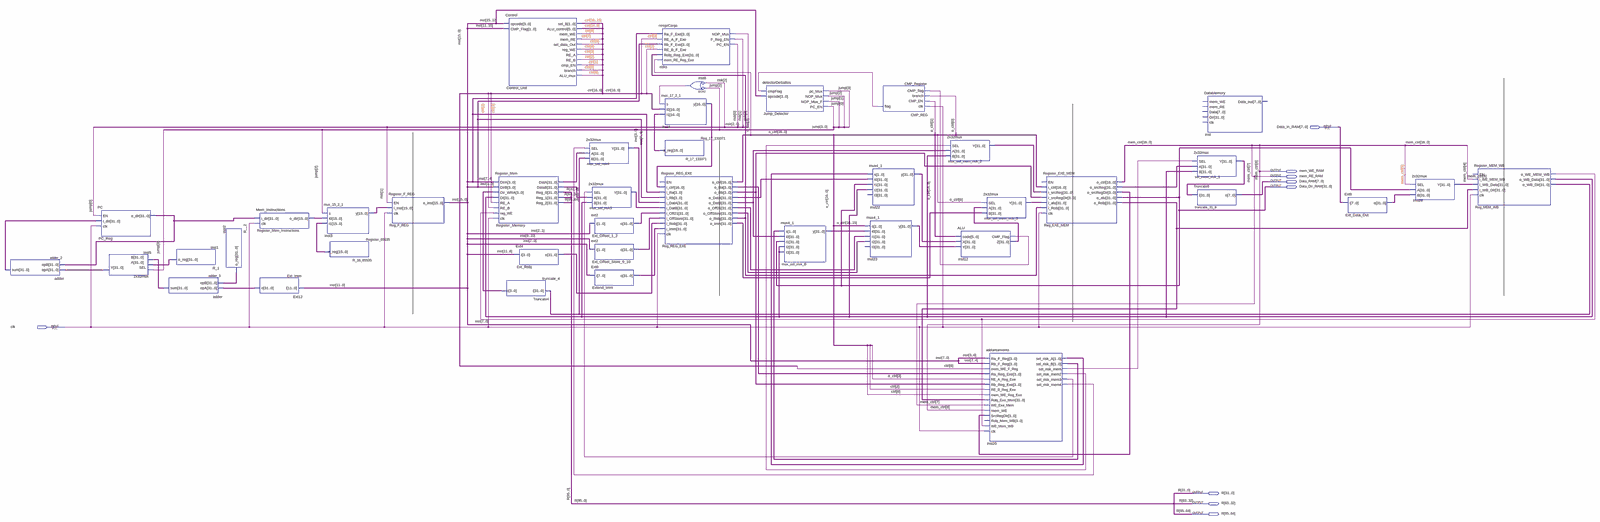
[diagram p0: schematic sheet, whole]
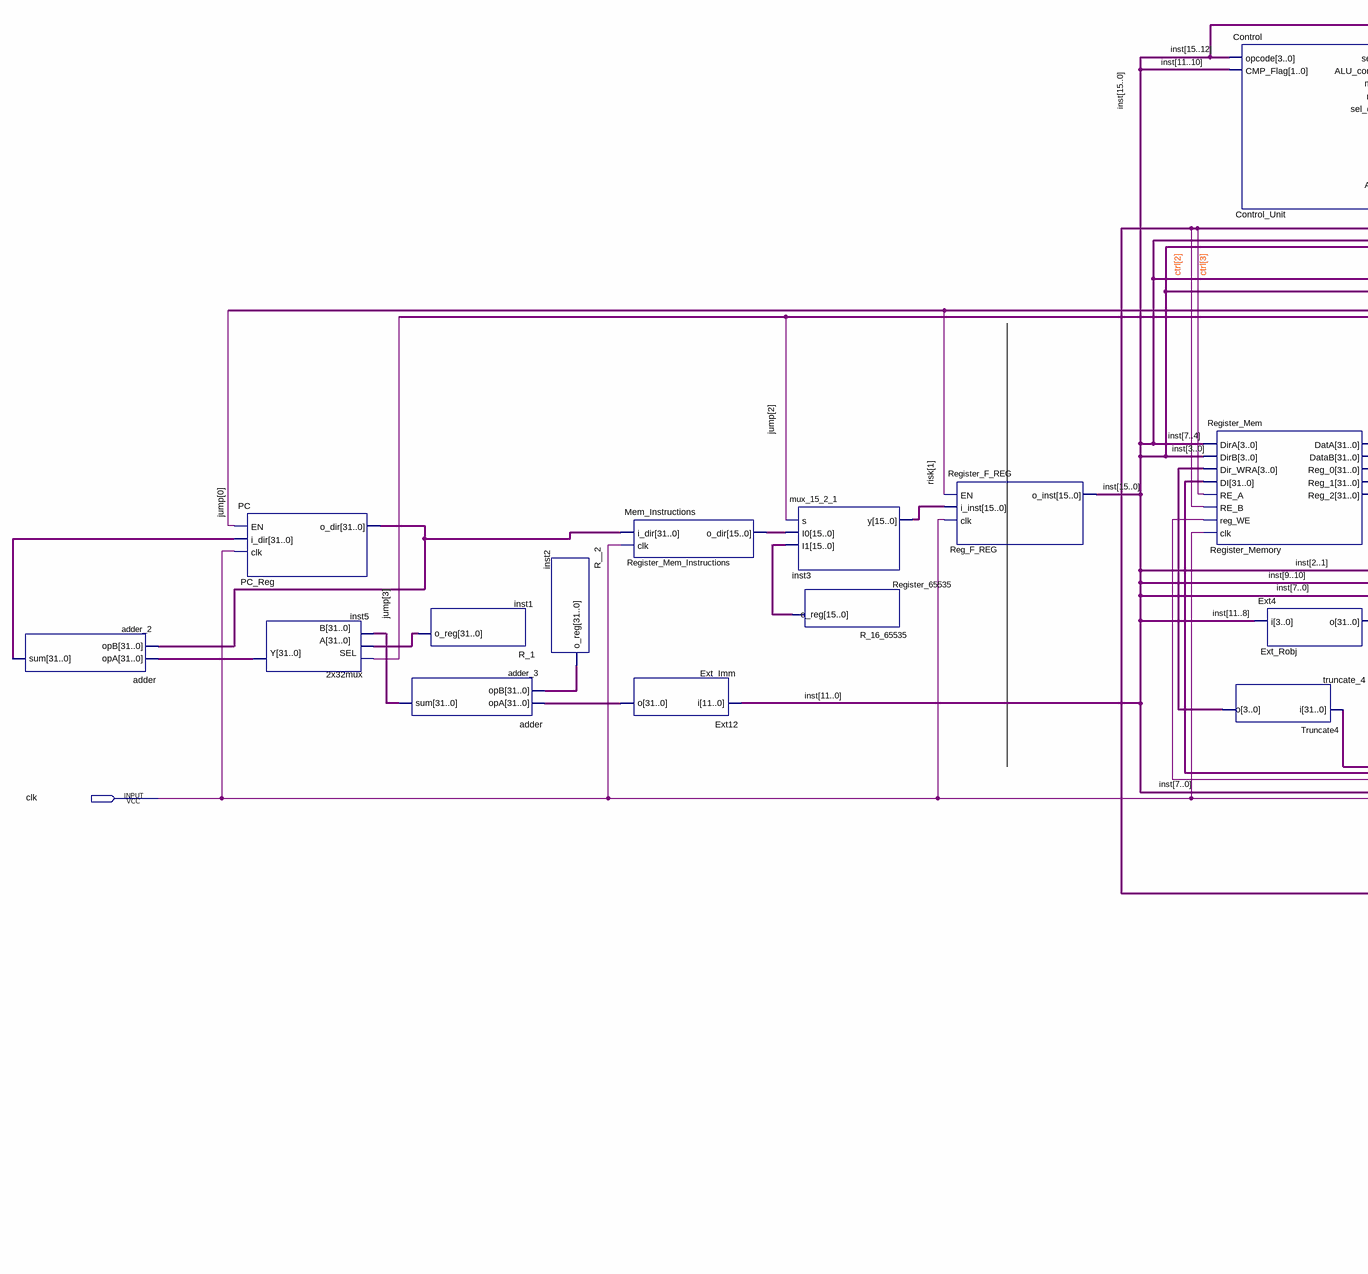
[diagram p1: schematic sheet, left part]
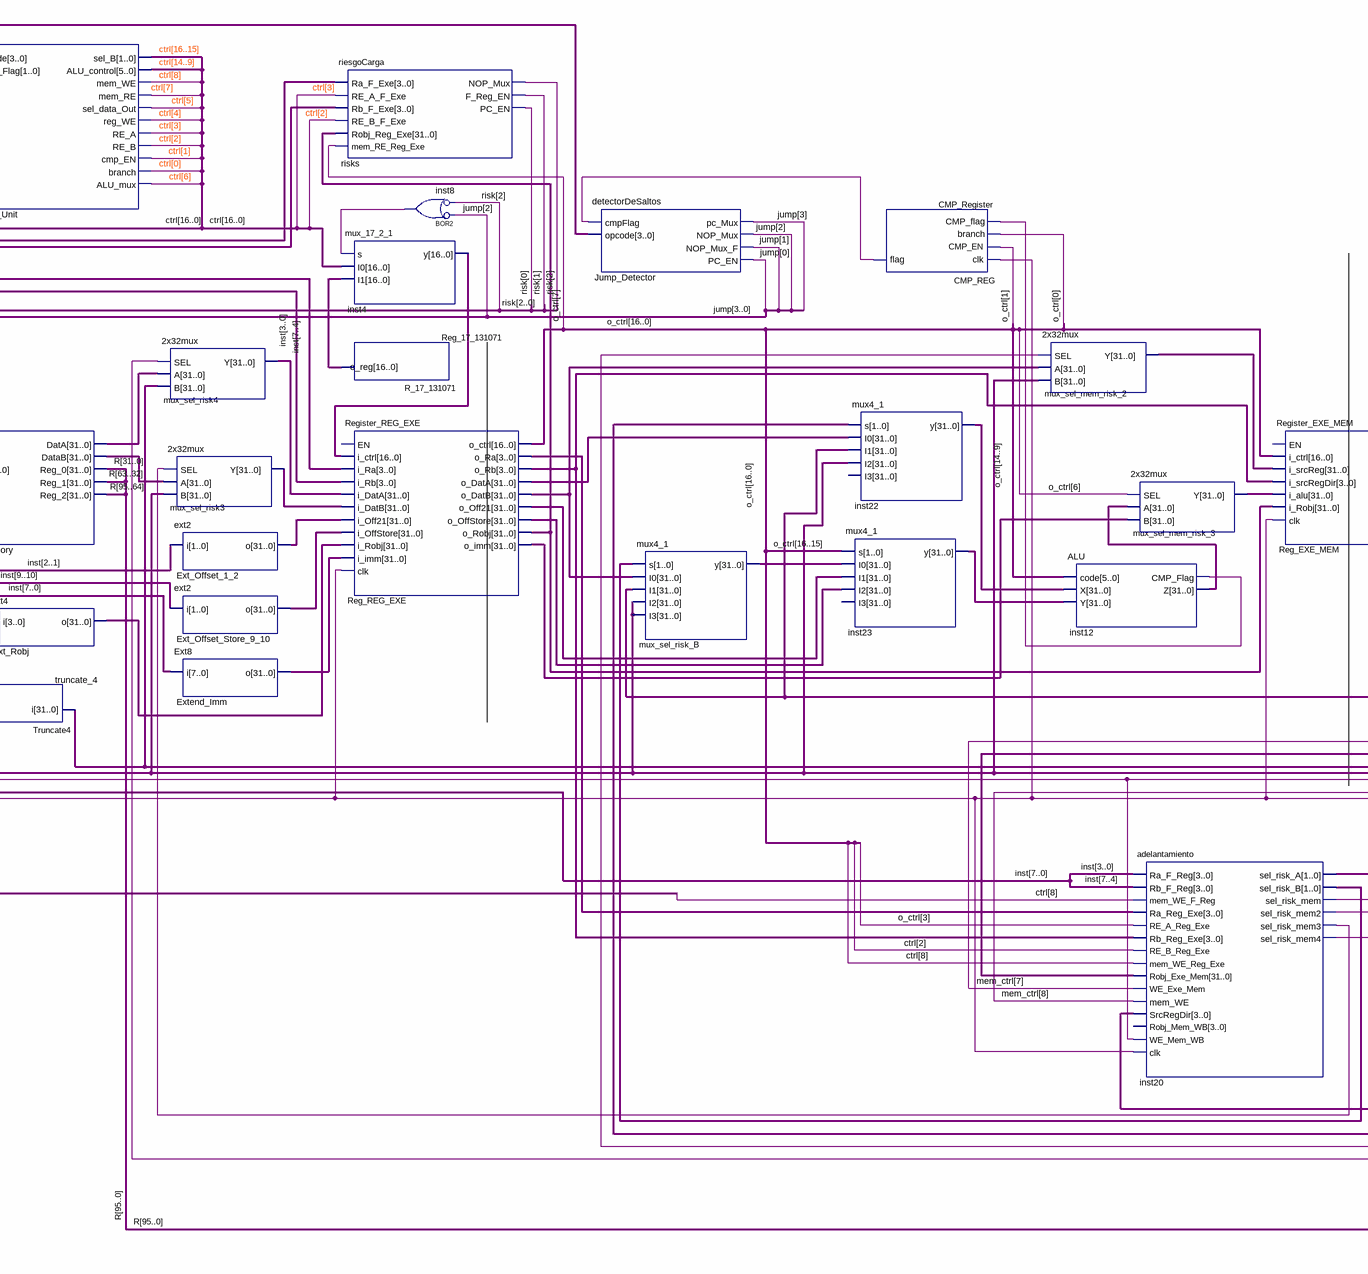
[diagram p2: schematic sheet, centre part]
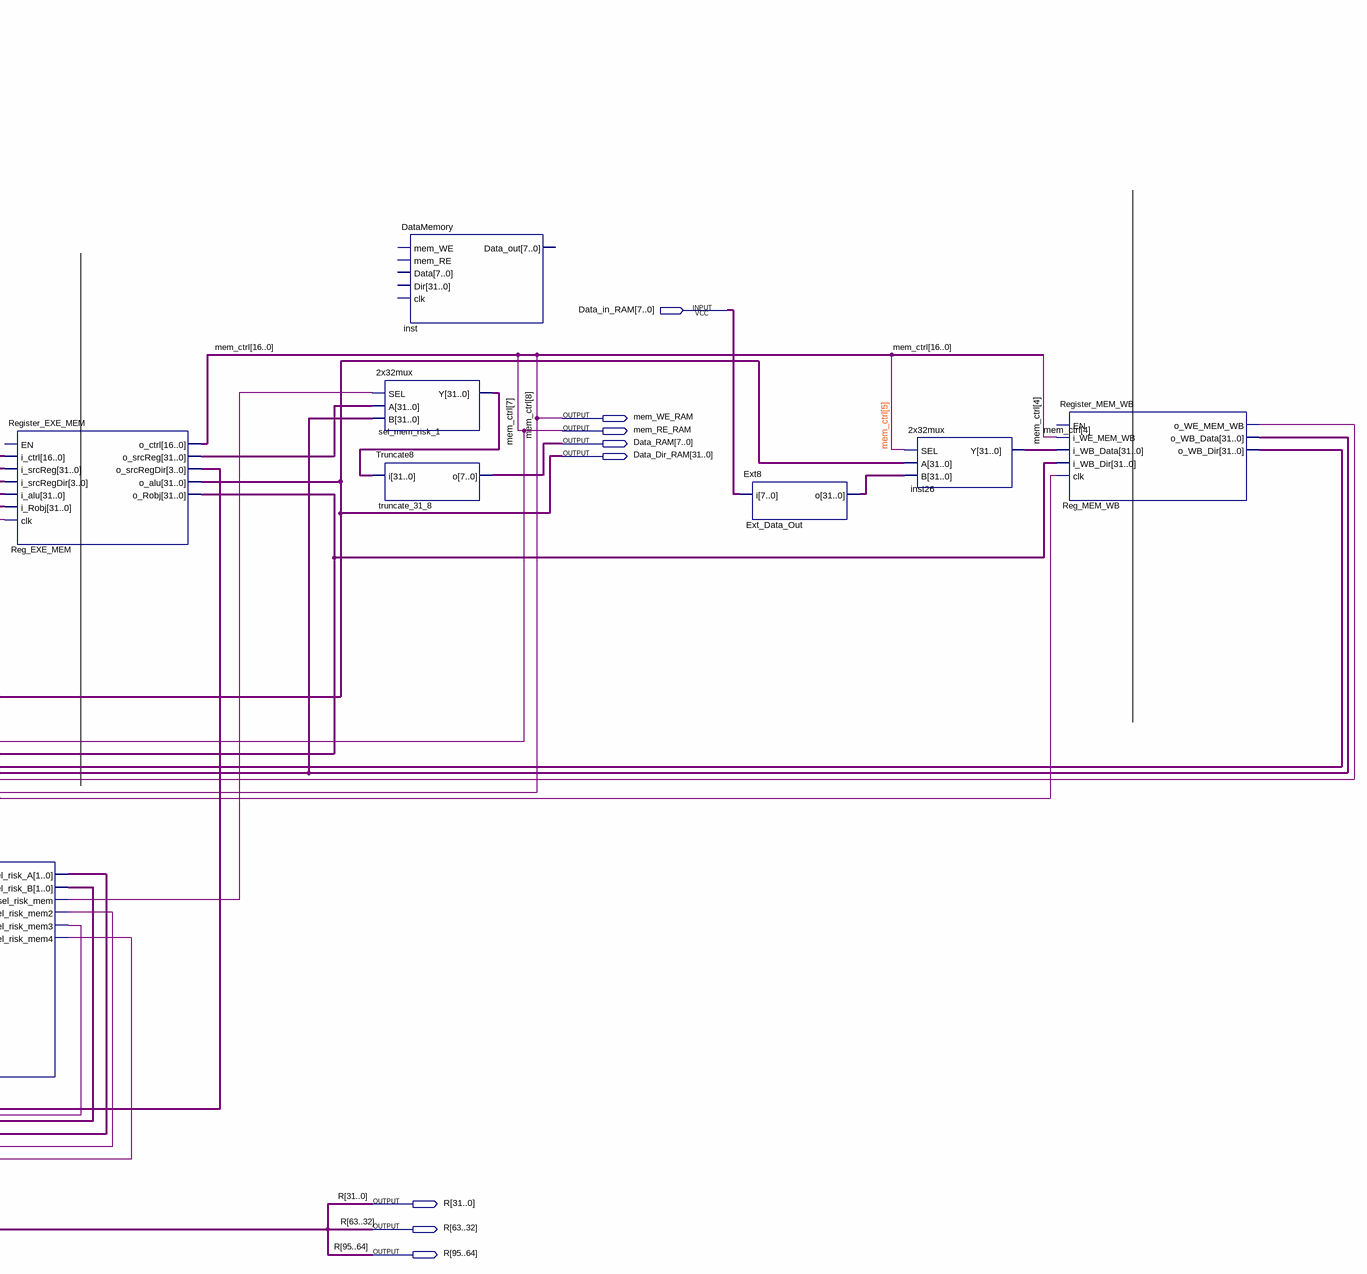
[diagram p3: schematic sheet, right part]
// Quartus schematic ProcesadorFiltros.bdf as structural Verilog: 41 symbols, 9 pins
module ProcesadorFiltros (
  input  [7:0] Data_in_RAM,
  input  clk,
  output mem_WE_RAM,
  output mem_RE_RAM,
  output [7:0] Data_RAM,
  output [31:0] Data_Dir_RAM,
  output [95:0] R
);

  wire CMP_Register_flag, inst8_out, inst12_cmp_flag, inst20_sel_risk_mem, inst20_sel_risk_mem2,
       inst20_sel_risk_mem3, inst20_sel_risk_mem4, Reg_MEM_WB_o_we_mem_wb;
  wire [1:0] inst20_sel_risk_a, inst20_sel_risk_b;
  wire [2:0] risk;
  wire [3:0] jump, Reg_EXE_MEM_o_srcregdir, Reg_REG_EXE_o_ra, Reg_REG_EXE_o_rb, truncate_4_o;
  wire [15:0] inst, inst3_y, Register_65535_o_reg, Register_Mem_Instructions_o_dir;
  wire [16:0] ctrl, inst4_y, mem_ctrl, o_ctrl, Reg_17_131071_o_reg;
  wire [31:0] adder_2_sum, adder_3_sum, Ext_Data_Out_o, Ext_Imm_o, Ext_Offset_1_2_o, Ext_Offset_Store_9_10_o,
       Ext_Robj_o, Extend_Imm_o, inst1_o_reg, inst2_o_reg, inst5_y, inst12_z, inst22_y, inst23_y, inst26_y,
       mux_sel_mem_risk_2_y, mux_sel_mem_risk_3_y, mux_sel_risk3_y, mux_sel_risk4_y, mux_sel_risk_B_y,
       PC_Reg_o_dir, Reg_EXE_MEM_o_robj, Reg_EXE_MEM_o_srcreg, Reg_MEM_WB_o_wb_data, Reg_MEM_WB_o_wb_dir,
       Reg_REG_EXE_o_data, Reg_REG_EXE_o_datb, Reg_REG_EXE_o_imm, Reg_REG_EXE_o_off21,
       Reg_REG_EXE_o_offstore, Reg_REG_EXE_o_robj, Register_Memory_data, Register_Memory_datab,
       sel_mem_risk_1_y;

  adder adder_2 (.opA(inst5_y), .opB(PC_Reg_o_dir), .sum(adder_2_sum));
  PC PC_Reg (.EN(jump[0]), .i_dir(adder_2_sum), .clk(clk), .o_dir(PC_Reg_o_dir));
  \2x32mux  inst5 (.SEL(jump[3]), .A(inst1_o_reg), .B(adder_3_sum), .Y(inst5_y));
  R_1 inst1 (.o_reg(inst1_o_reg));
  adder adder_3 (.opA(Ext_Imm_o), .opB(inst2_o_reg), .sum(adder_3_sum));
  R__2 inst2 (.o_reg(inst2_o_reg));
  Mem_Instructions Register_Mem_Instructions (.i_dir(PC_Reg_o_dir), .clk(clk), .o_dir(Register_Mem_Instructions_o_dir));
  Ext12 Ext_Imm (.i(inst[11:0]), .o(Ext_Imm_o));
  mux_15_2_1 inst3 (.s(jump[2]), .I0(Register_Mem_Instructions_o_dir), .I1(Register_65535_o_reg), .y(inst3_y));
  R_16_65535 Register_65535 (.o_reg(Register_65535_o_reg));
  Register_F_REG Reg_F_REG (.EN(risk[1]), .i_inst(inst3_y), .clk(clk), .o_inst(inst));
  Register_Mem Register_Memory (
    .DirA(inst[7:4]), .DirB(inst[3:0]), .Dir_WRA(truncate_4_o), .DI(Reg_MEM_WB_o_wb_data), .RE_A(ctrl[3]),
    .RE_B(ctrl[2]), .reg_WE(Reg_MEM_WB_o_we_mem_wb), .clk(clk), .DatA(Register_Memory_data),
    .DataB(Register_Memory_datab), .Reg_0(R[31:0]), .Reg_1(R[63:32]), .Reg_2(R[95:64]));
  Control Control_Unit (
    .opcode(inst[15:12]), .CMP_Flag(inst[11:10]), .sel_B(ctrl[16:15]), .ALU_control(ctrl[14:9]),
    .mem_WE(ctrl[8]), .mem_RE(ctrl[7]), .sel_data_Out(ctrl[5]), .reg_WE(ctrl[4]), .RE_A(ctrl[3]),
    .RE_B(ctrl[2]), .cmp_EN(ctrl[1]), .branch(ctrl[0]), .ALU_mux(ctrl[6]));
  Ext4 Ext_Robj (.i(inst[11:8]), .o(Ext_Robj_o));
  Truncate4 truncate_4 (.i(Reg_MEM_WB_o_wb_dir), .o(truncate_4_o));
  \2x32mux  mux_sel_risk4 (
    .SEL(inst20_sel_risk_mem4), .A(Register_Memory_data), .B(Reg_MEM_WB_o_wb_dir), .Y(mux_sel_risk4_y));
  \2x32mux  mux_sel_risk3 (
    .SEL(inst20_sel_risk_mem3), .A(Register_Memory_datab), .B(Reg_MEM_WB_o_wb_data), .Y(mux_sel_risk3_y));
  ext2 Ext_Offset_1_2 (.i(inst[2:1]), .o(Ext_Offset_1_2_o));
  ext2 Ext_Offset_Store_9_10 (.i({inst[9], inst[10]}), .o(Ext_Offset_Store_9_10_o));
  Ext8 Extend_Imm (.i(inst[7:0]), .o(Extend_Imm_o));
  riesgoCarga risks (
    .Ra_F_Exe(inst[7:4]), .RE_A_F_Exe(ctrl[3]), .Rb_F_Exe(inst[3:0]), .RE_B_F_Exe(ctrl[2]),
    .Robj_Reg_Exe(Reg_REG_EXE_o_robj), .mem_RE_Reg_Exe(o_ctrl[7]), .NOP_Mux(risk[2]), .F_Reg_EN(risk[1]),
    .PC_EN(risk[0]));
  mux_17_2_1 inst4 (.s(inst8_out), .I0(ctrl), .I1(Reg_17_131071_o_reg), .y(inst4_y));
  R_17_131071 Reg_17_131071 (.o_reg(Reg_17_131071_o_reg));
  Register_REG_EXE Reg_REG_EXE (
    .i_ctrl(inst4_y), .i_Ra(inst[7:4]), .i_Rb(inst[3:0]), .i_DatA(mux_sel_risk4_y), .i_DatB(mux_sel_risk3_y),
    .i_Off21(Ext_Offset_1_2_o), .i_OffStore(Ext_Offset_Store_9_10_o), .i_Robj(Ext_Robj_o),
    .i_imm(Extend_Imm_o), .clk(clk), .o_ctrl(o_ctrl), .o_Ra(Reg_REG_EXE_o_ra), .o_Rb(Reg_REG_EXE_o_rb),
    .o_DatA(Reg_REG_EXE_o_data), .o_DatB(Reg_REG_EXE_o_datb), .o_Off21(Reg_REG_EXE_o_off21),
    .o_OffStore(Reg_REG_EXE_o_offstore), .o_Robj(Reg_REG_EXE_o_robj), .o_imm(Reg_REG_EXE_o_imm));  // open: EN
  or inst8 (inst8_out, ~jump[2], ~risk[2]);  // BOR2
  detectorDeSaltos Jump_Detector (
    .cmpFlag(CMP_Register_flag), .opcode(inst[15:12]), .pc_Mux(jump[3]), .NOP_Mux(jump[2]),
    .NOP_Mux_F(jump[1]), .PC_EN(jump[0]));
  mux4_1 mux_sel_risk_B (
    .s(inst20_sel_risk_b), .I0(Reg_REG_EXE_o_datb), .I1(Data_Dir_RAM), .I2(Reg_MEM_WB_o_wb_data),
    .I3(Reg_MEM_WB_o_wb_data), .y(mux_sel_risk_B_y));
  mux4_1 inst22 (
    .s(inst20_sel_risk_a), .I0(Reg_REG_EXE_o_data), .I1(Data_Dir_RAM), .I2(Reg_MEM_WB_o_wb_data), .y(inst22_y));  // open: I3
  mux4_1 inst23 (
    .s(o_ctrl[16:15]), .I0(mux_sel_risk_B_y), .I1(Reg_REG_EXE_o_off21), .I2(Reg_REG_EXE_o_offstore),
    .y(inst23_y));  // open: I3
  CMP_REG CMP_Register (
    .clk(clk), .CMP_EN(o_ctrl[1]), .branch(o_ctrl[0]), .CMP_flag(inst12_cmp_flag), .flag(CMP_Register_flag));
  \2x32mux  mux_sel_mem_risk_2 (
    .SEL(inst20_sel_risk_mem2), .A(Reg_REG_EXE_o_datb), .B(Reg_MEM_WB_o_wb_data), .Y(mux_sel_mem_risk_2_y));
  ALU inst12 (.code(o_ctrl[14:9]), .X(inst22_y), .Y(inst23_y), .CMP_Flag(inst12_cmp_flag), .Z(inst12_z));
  \2x32mux  mux_sel_mem_risk_3 (.SEL(o_ctrl[6]), .A(inst12_z), .B(Reg_REG_EXE_o_imm), .Y(mux_sel_mem_risk_3_y));
  adelantamiento inst20 (
    .Ra_F_Reg(inst[3:0]), .Rb_F_Reg(inst[7:4]), .mem_WE_F_Reg(ctrl[8]), .Ra_Reg_Exe(Reg_REG_EXE_o_ra),
    .RE_A_Reg_Exe(o_ctrl[3]), .Rb_Reg_Exe(Reg_REG_EXE_o_rb), .RE_B_Reg_Exe(ctrl[2]),
    .mem_WE_Reg_Exe(ctrl[8]), .Robj_Exe_Mem(Reg_EXE_MEM_o_robj), .WE_Exe_Mem(mem_RE_RAM),
    .mem_WE(mem_WE_RAM), .SrcRegDir(Reg_EXE_MEM_o_srcregdir), .WE_Mem_WB(Reg_MEM_WB_o_we_mem_wb), .clk(clk),
    .sel_risk_A(inst20_sel_risk_a), .sel_risk_B(inst20_sel_risk_b), .sel_risk_mem(inst20_sel_risk_mem),
    .sel_risk_mem2(inst20_sel_risk_mem2), .sel_risk_mem3(inst20_sel_risk_mem3),
    .sel_risk_mem4(inst20_sel_risk_mem4));  // open: Robj_Mem_WB
  Register_EXE_MEM Reg_EXE_MEM (
    .i_ctrl(o_ctrl), .i_srcReg(mux_sel_mem_risk_2_y), .i_srcRegDir(Reg_REG_EXE_o_rb),
    .i_alu(mux_sel_mem_risk_3_y), .i_Robj(Reg_REG_EXE_o_robj), .clk(clk),
    .o_ctrl({mem_ctrl[16:9], mem_WE_RAM, mem_RE_RAM, mem_ctrl[6:0]}), .o_srcReg(Reg_EXE_MEM_o_srcreg),
    .o_srcRegDir(Reg_EXE_MEM_o_srcregdir), .o_alu(Data_Dir_RAM), .o_Robj(Reg_EXE_MEM_o_robj));  // open: EN
  \2x32mux  sel_mem_risk_1 (
    .SEL(inst20_sel_risk_mem), .A(Reg_EXE_MEM_o_srcreg), .B(Reg_MEM_WB_o_wb_data), .Y(sel_mem_risk_1_y));
  Truncate8 truncate_31_8 (.i(sel_mem_risk_1_y), .o(Data_RAM));
  DataMemory u_inst ();  // open: mem_WE, mem_RE, Data, Dir, clk, Data_out
  Ext8 Ext_Data_Out (.i(Data_in_RAM), .o(Ext_Data_Out_o));
  \2x32mux  inst26 (.SEL(mem_ctrl[5]), .A(Data_Dir_RAM), .B(Ext_Data_Out_o), .Y(inst26_y));
  Register_MEM_WB Reg_MEM_WB (
    .i_WE_MEM_WB(mem_ctrl[4]), .i_WB_Data(inst26_y), .i_WB_Dir(Reg_EXE_MEM_o_robj), .clk(clk),
    .o_WE_MEM_WB(Reg_MEM_WB_o_we_mem_wb), .o_WB_Data(Reg_MEM_WB_o_wb_data), .o_WB_Dir(Reg_MEM_WB_o_wb_dir));  // open: EN

  // Other names for the same wires on the sheet: mem_ctrl[8:7] = {mem_WE_RAM, mem_RE_RAM}
endmodule
